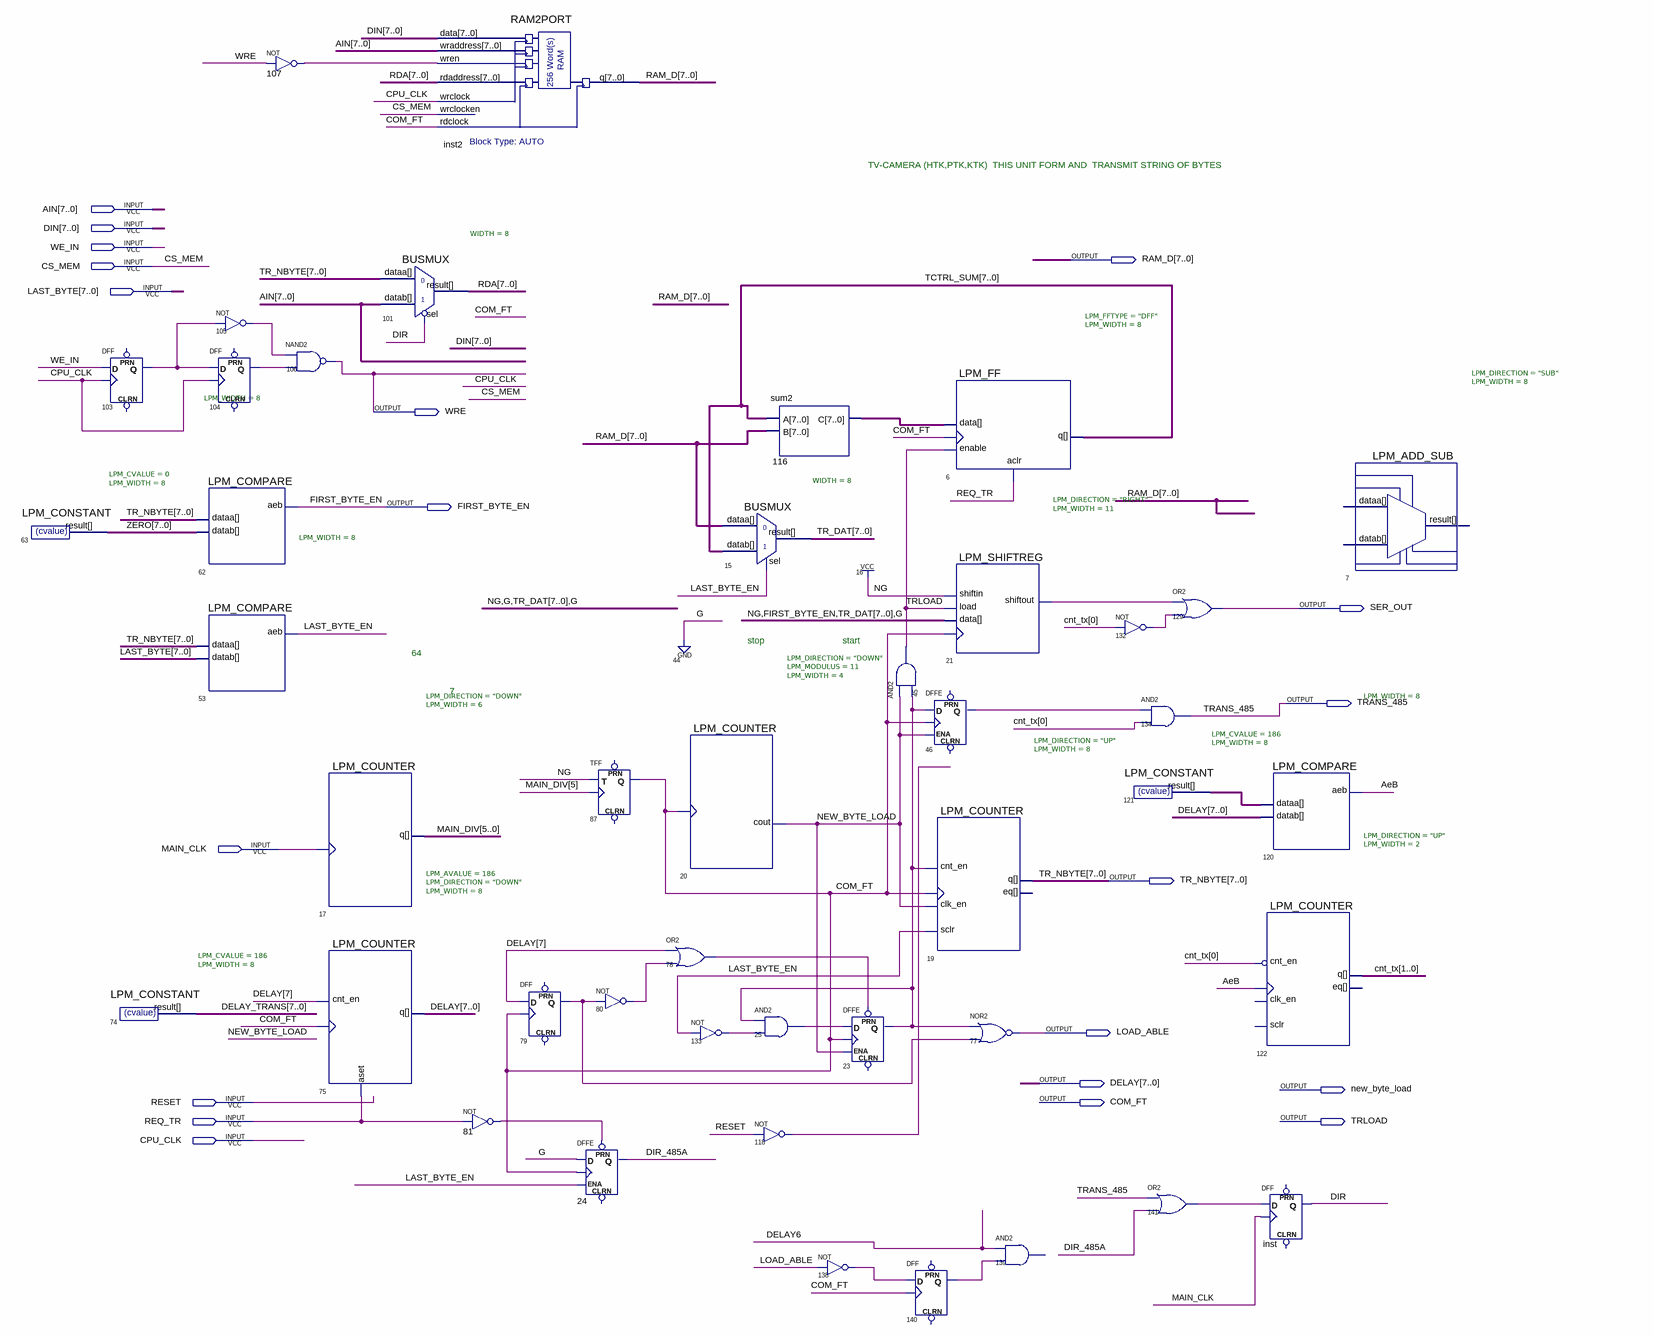
[diagram p0: schematic sheet]
// Quartus schematic tr_string.bdf as structural Verilog: 44 symbols, 20 pins
module tr_string (
  input  [7:0] AIN,
  input  [7:0] DIN,
  input  WE_IN,
  input  CS_MEM,
  input  [7:0] LAST_BYTE,
  input  MAIN_CLK,
  input  RESET,
  input  REQ_TR,
  input  CPU_CLK,
  output [7:0] RAM_D,
  output WRE,
  output FIRST_BYTE_EN,
  output SER_OUT,
  output TRANS_485,
  output [7:0] TR_NBYTE,
  output LOAD_ABLE,
  output [7:0] DELAY,
  output new_byte_load,
  output COM_FT,
  output TRLOAD
);

  wire AeB, DIR, DIR_485A, LAST_BYTE_EN, n21_shiftout, n23_q, n25_out, n46_q, n78_out, n79_q, n80_out,
       n81_out, n103_q, n104_q, n105_out, n107_out, n118_out, n132_out, n133_out, n138_out, n140_q, n141_out;
  wire [1:0] cnt_tx;
  wire [5:0] MAIN_DIV;
  wire [7:0] DELAY_TRANS, n116_c, n121_result, RDA, TCTRL_SUM, TR_DAT, ZERO;

  LPM_CONSTANT #(.LPM_CVALUE(0), .LPM_WIDTH(8)) u_63 (.result(ZERO));
  DFF u_103 (.CLK(CPU_CLK), .D(WE_IN), .Q(n103_q));  // open: CLRN, PRN
  LPM_CONSTANT #(.LPM_CVALUE(186), .LPM_WIDTH(8)) u_74 (.result(DELAY_TRANS));
  not u_105 (n105_out, n103_q);
  DFF u_104 (.CLK(CPU_CLK), .D(n103_q), .Q(n104_q));  // open: CLRN, PRN
  LPM_COMPARE #(.LPM_WIDTH(8)) u_62 (.dataa(TR_NBYTE), .datab(ZERO), .aeb(FIRST_BYTE_EN));
  LPM_COMPARE #(.LPM_WIDTH(8)) u_53 (.dataa(TR_NBYTE), .datab(LAST_BYTE), .aeb(LAST_BYTE_EN));
  not u_107 (n107_out, WRE);
  nand u_106 (WRE, n105_out, n104_q);
  LPM_COUNTER #(.LPM_DIRECTION("DOWN"), .LPM_WIDTH(6)) u_17 (.clock(MAIN_CLK), .q(MAIN_DIV));
  LPM_COUNTER #(.LPM_AVALUE(186), .LPM_DIRECTION("DOWN"), .LPM_WIDTH(8)) u_75 (
    .cnt_en(DELAY[7]), .clock(COM_FT), .aset(REQ_TR), .q(DELAY));
  BUSMUX #(.WIDTH(8)) u_101 (.datab(AIN), .sel(~DIR), .dataa(TR_NBYTE), .result(RDA));
  RAM2PORT inst2 (
    .data(DIN), .wraddress(AIN), .wren(n107_out), .rdaddress(RDA), .wrclock(CPU_CLK), .wrclocken(CS_MEM),
    .rdclock(COM_FT), .q(RAM_D));
  not u_81 (n81_out, REQ_TR);
  DFF u_79 (.CLK(COM_FT), .D(DELAY[7]), .Q(n79_q));  // open: CLRN, PRN
  TFF u_87 (.T(1'b1), .CLK(MAIN_DIV[5]), .Q(COM_FT));  // open: PRN, CLRN
  DFFE u_24 (.PRN(n81_out), .D(1'b0), .CLK(COM_FT), .ENA(LAST_BYTE_EN), .Q(DIR_485A));  // open: CLRN
  not u_80 (n80_out, n79_q);
  LPM_COUNTER #(.LPM_DIRECTION("DOWN"), .LPM_MODULUS(11), .LPM_WIDTH(4)) u_20 (.clock(COM_FT), .cout(new_byte_load));
  or u_78 (n78_out, DELAY[7], n80_out);
  not u_133 (n133_out, LAST_BYTE_EN);
  BUSMUX #(.WIDTH(8)) u_15 (.datab(TCTRL_SUM), .sel(LAST_BYTE_EN), .dataa(RAM_D), .result(TR_DAT));
  sum2 u_116 (.A(TCTRL_SUM), .B(RAM_D), .C(n116_c));
  and u_25 (n25_out, n23_q, n133_out);
  not u_118 (n118_out, RESET);
  DFFE u_23 (.PRN(n78_out), .D(n25_out), .CLK(COM_FT), .ENA(new_byte_load), .Q(n23_q));  // open: CLRN
  not u_138 (n138_out, LOAD_ABLE);
  and u_45 (TRLOAD, new_byte_load, n23_q);
  LPM_FF #(.LPM_FFTYPE("DFF"), .LPM_WIDTH(8)) u_6 (
    .enable(TRLOAD), .clock(COM_FT), .aclr(REQ_TR), .data(n116_c), .q(TCTRL_SUM));
  LPM_SHIFTREG #(.LPM_DIRECTION("RIGHT"), .LPM_WIDTH(11)) u_21 (
    .shiftin(1'b1), .clock(COM_FT), .data({1'b1, FIRST_BYTE_EN, TR_DAT, 1'b0}), .load(TRLOAD),
    .shiftout(n21_shiftout));
  DFFE u_46 (.D(n23_q), .CLK(COM_FT), .ENA(new_byte_load), .Q(n46_q));  // open: PRN, CLRN
  LPM_COUNTER #(.LPM_DIRECTION("UP"), .LPM_WIDTH(8)) u_19 (
    .cnt_en(n23_q), .clock(COM_FT), .clk_en(new_byte_load), .sclr(LAST_BYTE_EN), .q(TR_NBYTE));  // open: eq
  DFF u_140 (.CLK(COM_FT), .D(n138_out), .Q(n140_q));  // open: CLRN, PRN
  nor u_77 (LOAD_ABLE, n23_q, n79_q);
  // AND2 139 has open pins: IN1=DELAY[6], IN2=n140_q, OUT=open
  not u_132 (n132_out, cnt_tx[0]);
  and u_134 (TRANS_485, n46_q, cnt_tx[0]);
  LPM_CONSTANT #(.LPM_CVALUE(186), .LPM_WIDTH(8)) u_121 (.result(n121_result));
  or u_141 (n141_out, TRANS_485, DIR_485A);
  or u_129 (SER_OUT, n21_shiftout, n132_out);
  LPM_COMPARE #(.LPM_WIDTH(8)) u_120 (.dataa(n121_result), .datab(DELAY), .aeb(AeB));
  LPM_COUNTER #(.LPM_DIRECTION("UP"), .LPM_WIDTH(2)) u_122 (
    .cnt_en(~cnt_tx[0]), .clock(AeB), .q(cnt_tx));  // open: clk_en, sclr, eq
  DFF inst (.CLK(MAIN_CLK), .D(n141_out), .Q(DIR));  // open: CLRN, PRN
  LPM_ADD_SUB #(.LPM_DIRECTION("SUB"), .LPM_WIDTH(8)) u_7 ();  // open: datab, dataa, result

  // Notes on the sheet:
  //   TV-CAMERA (HTK,PTK,KTK)  THIS UNIT FORM AND  TRANSMIT STRING OF BYTES
  //   stop
  //   start
  //   64
  //   7
endmodule
